# Altium project XBOT高端控制盒V1_1.PrjPcb
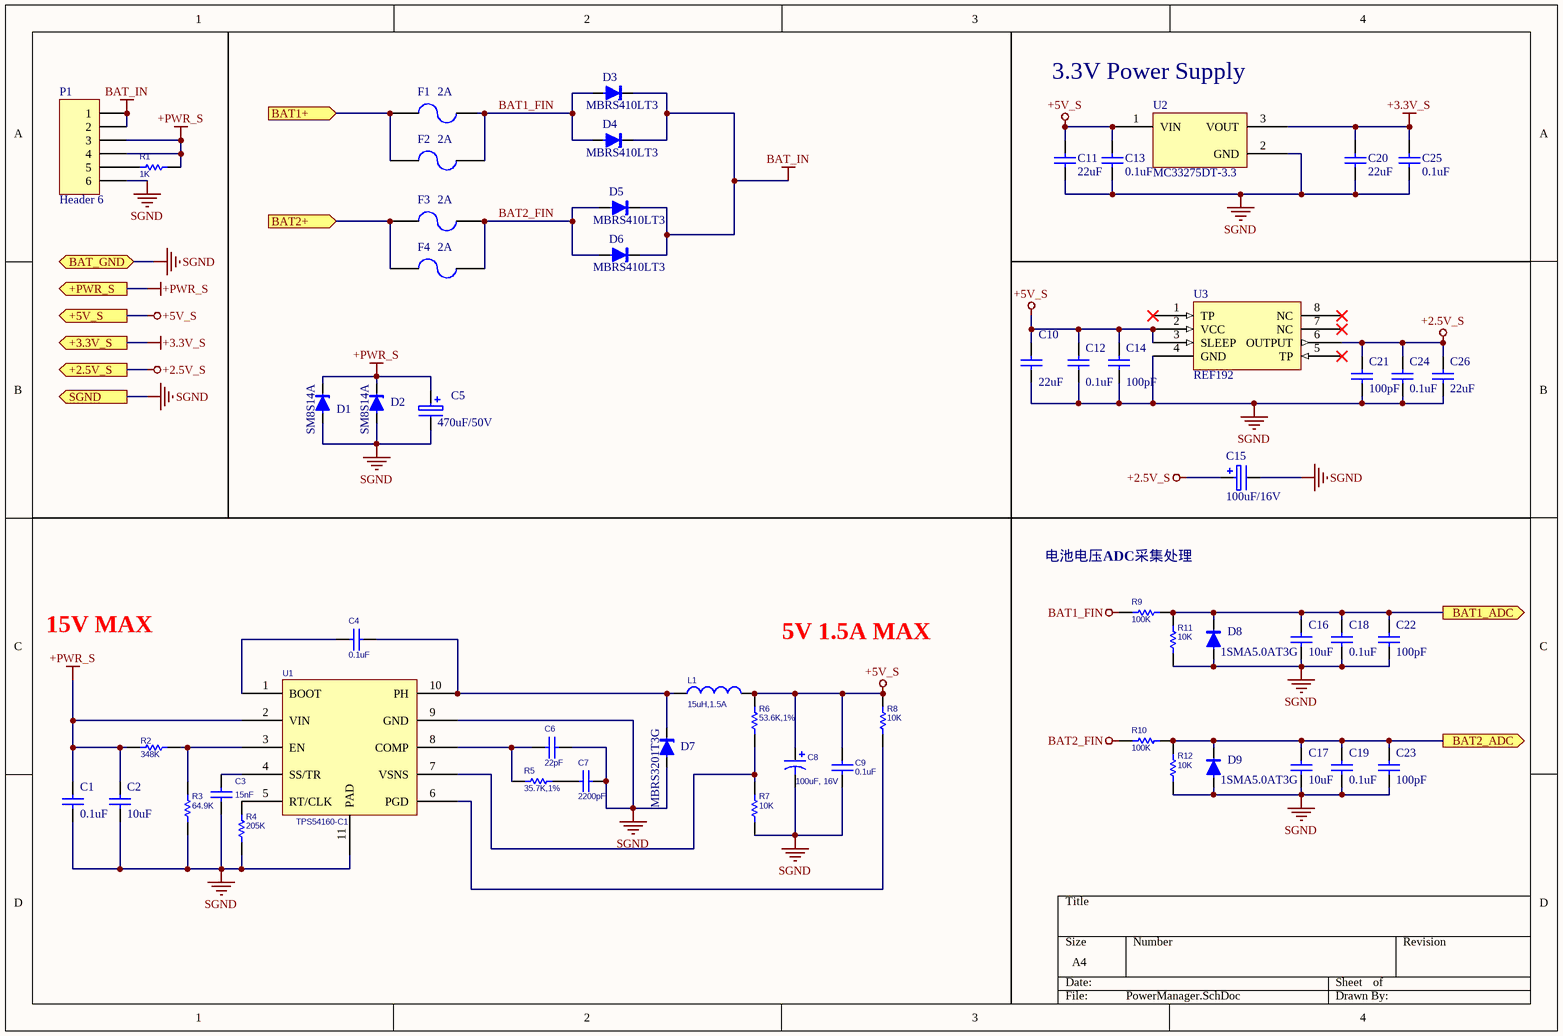
[diagram p0: PowerManager.SchDoc]
7 sheets, 289 parts. Net scope: global (net labels, ports and power ports of the same name join across sheets).
Board file: 控制盒基板.PcbDoc
Sheets:
  PowerManager.SchDoc
  KeyInput_ABH.SchDoc
  KeyInput_IJMEF.SchDoc
  JoyStickAdcInput.SchDoc
  OmapSystem.SchDoc
  TTL_TO_RS485.SchDoc
  RightInterface.SchDoc

## Sheet PowerManager.SchDoc
size A4

### Parts
C1  0.1uF  [C0805]
C2  10uF  [C1206]
C3  15nF  [C0805]
C4  0.1uF  [C0805]
C5  470uF/50V  [CT7343-E]
C6  22pF  [R0805]
C7  2200pF  [C0805]
C8  100uF, 16V  [CT7343-E]
C9  0.1uF  [C0805]
C10  22uF  [C1206]
C11  22uF  [C1206]
C12  0.1uF  [C0805]
C13  0.1uF  [C0805]
C14  100pF  [C0805]
C15  100uF/16V  [CT7343-E]
C16  10uF  [C1206]
C17  10uF  [C1206]
C18  0.1uF  [C1206]
C19  0.1uF  [C1206]
C20  22uF  [C1206]
C21  100pF  [C0805]
C22  100pF  [C1206]
C23  100pF  [C1206]
C24  0.1uF  [C0805]
C25  0.1uF  [C0805]
C26  22uF  [C1206]
D1  SM8S14A  [DO-218AB]
D2  SM8S14A  [DO-218AB]
D3  MBRS410LT3  [SMC]
D4  MBRS410LT3  [SMC]
D5  MBRS410LT3  [SMC]
D6  MBRS410LT3  [SMC]
D7  MBRS3201T3G  [DO-218AB]
D8  1SMA5.0AT3G  [SMA-S]
D9  1SMA5.0AT3G  [SMA-S]
F1  2A  [F1812]
F2  2A  [F1812]
F3  2A  [F1812]
F4  2A  [F1812]
L1  15uH,1.5A  [L5050-P]
P1  Header 6  [DS1X6-2.54]
R1  1K  [R0805]
R2  348K  [R0805]
R3  64.9K  [R0805]
R4  205K  [R0805]
R5  35.7K,1%  [R0805]
R6  53.6K,1%  [R0805]
R7  10K  [R0805]
R8  10K  [R0805]
R9  100K  [R0805]
R10  100K  [R0805]
R11  10K  [R0805]
R12  10K  [R0805]
U1  TPS54160-C1  [TSSO3X5-G10]
U2  MC33275DT-3.3  [TO-252]
U3  REF192  [SO-8]

### Ports
+2.5V_S (out), +3.3V_S (out), +5V_S (out), +PWR_S (out), BAT1+ (in), BAT1_ADC (out), BAT2+ (in), BAT2_ADC (out), BAT_GND, SGND (out)

### Nets
+2.5V_S: C15.1 C21.2 C24.2 C26.2 U3.6(OUTPUT) ; port +2.5V_S
+3.3V_S: C20.1 C25.2 U2.3(VOUT) ; port +3.3V_S
+5V_S: C8.1 C9.1 C10.2 C11.1 C12.2 C13.2 C14.2 L1.2 R6.2 R8.2 U2.1(VIN) U3.2(VCC) U3.3(SLEEP) ; port +5V_S
+PWR_S: C1.2 C2.2 C5.1 D1.2(K) D2.2(K) P1.3 P1.4 R1.1 R2.1 U1.2(VIN) ; port +PWR_S
BAT1_FIN: D3.1(A) D4.1(A) F1.2 F2.2 R9.1
BAT2_FIN: D5.1(A) D6.1(A) F3.2 F4.2 R10.1
BAT_IN: D3.2(K) D4.2(K) D5.2(K) D6.2(K) P1.1 P1.2
SGND: C1.1 C2.1 C3.1 C5.2 C6.1 C7.1 C8.2 C9.2 C10.1 C11.2 C12.1 C13.1 C14.1 C15.2 C16.1 C17.1 C18.1 C19.1 C20.2 C21.1 C22.1 C23.1 C24.1 C25.1 C26.1 D1.1(A) D2.1(A) D7.1(A) D8.1(A) D9.1(A) P1.6 R3.1 R4.1 R7.1 R11.2 R12.2 U1.9(GND) U1.11(PAD) U2.2(GND) U3.4(GND) ; port BAT_GND, port SGND
BAT1_ADC: C16.2 C18.2 C22.2 D8.2(K) R9.2 R11.1 ; port BAT1_ADC
BAT1_IN: F1.1 F2.1 ; port BAT1+
BAT2_ADC: C17.2 C19.2 C23.2 D9.2(K) R10.2 R12.1 ; port BAT2_ADC
BAT2_IN: F3.1 F4.1 ; port BAT2+
NetC3_2: C3.2 U1.4(SS/TR)
NetC4_1: C4.1 D7.2(K) L1.1 U1.10(PH)
NetC4_2: C4.2 U1.1(BOOT)
NetC6_2: C6.2 R5.2 U1.8(COMP)
NetC7_2: C7.2 R5.1
NetP1_5: P1.5 R1.2
NetR2_2: R2.2 R3.2 U1.3(EN)
NetR4_2: R4.2 U1.5(RT/CLK)
NetR6_1: R6.1 R7.2 U1.7(VSNS)
NetR8_1: R8.1 U1.6(PGD)

Not connected (* = marked no-connect by the designer): U3 1(TP)* 5(TP)* 7(NC)* 8(NC)*

### Notes on the sheet
- (near U2) 3.3V Power Supply
- (near R9) 电池电压ADC采集处理
- 15V MAX
- 5V 1.5A MAX

### Library data of the parts
C1 C2 C10-C14 C16-C26 = CAP: Published: 8-Jun-2000; LatestRevisionDate: 17-Jul-2002; LatestRevisionNote: Re-released for DXP Platform.; PackageReference: RAD-0.3; Publisher: Altium Limited
  C1 C12 C13 C18 C19 C24 C25: Value: 0.1uF
  C2 C16 C17: Value: 10uF
  C10 C11 C20 C26: Value: 22uF
  C14 C21-C23: Value: 100pF
C3 = Cap: CAP, CERAMIC, 15nF, 16V, X5R, 0603; Published: 8-Jun-2000; LatestRevisionDate: 17-Jul-2002; LatestRevisionNote: Re-released for DXP Platform.; PackageReference: RAD-0.3; Publisher: Altium Limited; Value: 15nF
C4 C9 = Cap: CAP, CERAMIC, 0.1UF, 16V, X5R, 0603; Value: 15nF; Published: 8-Jun-2000; LatestRevisionDate: 17-Jul-2002; LatestRevisionNote: Re-released for DXP Platform.; PackageReference: RAD-0.3; Publisher: Altium Limited
C5 = ELECTRO: Electrolytic Capacitor
C6 C7 = Cap: Capacitor; Value: 15nF; Published: 8-Jun-2000; LatestRevisionDate: 17-Jul-2002; LatestRevisionNote: Re-released for DXP Platform.; PackageReference: RAD-0.3; Publisher: Altium Limited
C8 = Cap Pol1: Polarized Capacitor (Radial); Value: 10uF; Published: 8-Jun-2000; LatestRevisionDate: 17-Jul-2002; LatestRevisionNote: Re-released for DXP Platform.; PackageReference: RB7.6-15; Publisher: Altium Limited
C15 = CAP-ELECTRO: Electrolytic Capacitor
D1-D7 = DIODE-ZENER: Small Signal Zener Diodes
D8 D9 = DIODE-SWITCHING: Silicon Epitaxial Planar Diodes
F1-F4 = FUSE2: Fuse
L1 = Inductor: Code_IEC: 1005; Value: 10mH; Published: 8-Jun-2000; LatestRevisionDate: 29-May-2009; LatestRevisionNote: IPC-7351 Footprint Added.; PackageReference: 0402-A; Publisher: Altium Limited; PackageDescription: Chip Inductor; Code_JEITA: 0402
P1 = Header 6: Header, 6-Pin; LatestRevisionDate: 17-Jul-2002; LatestRevisionNote: Re-released for DXP Platform.; Publisher: Altium Limited
R1 R3-R12 = Res1: Resistor; Value: 348K; Published: 8-Jun-2000; LatestRevisionDate: 17-Jul-2002; LatestRevisionNote: Re-released for DXP Platform.; PackageReference: AXIAL-0.3; Publisher: Altium Limited
R2 = Res1: Resistor; Published: 8-Jun-2000; LatestRevisionDate: 17-Jul-2002; LatestRevisionNote: Re-released for DXP Platform.; PackageReference: AXIAL-0.3; Publisher: Altium Limited; Value: 348K
U2 = MC78MXX: 3-Terminal 0.5A Positive Voltage Regulator; Published: 24-Mar-1999; LatestRevisionDate: 17-Jul-2002; LatestRevisionNote: Re-released for DXP Platform.; PackageReference: D2PAK; Publisher: Altium Limited; Code_JEDEC: SMD-220
U3 = REF192/5/7

## Sheet KeyInput_ABH.SchDoc
size A4
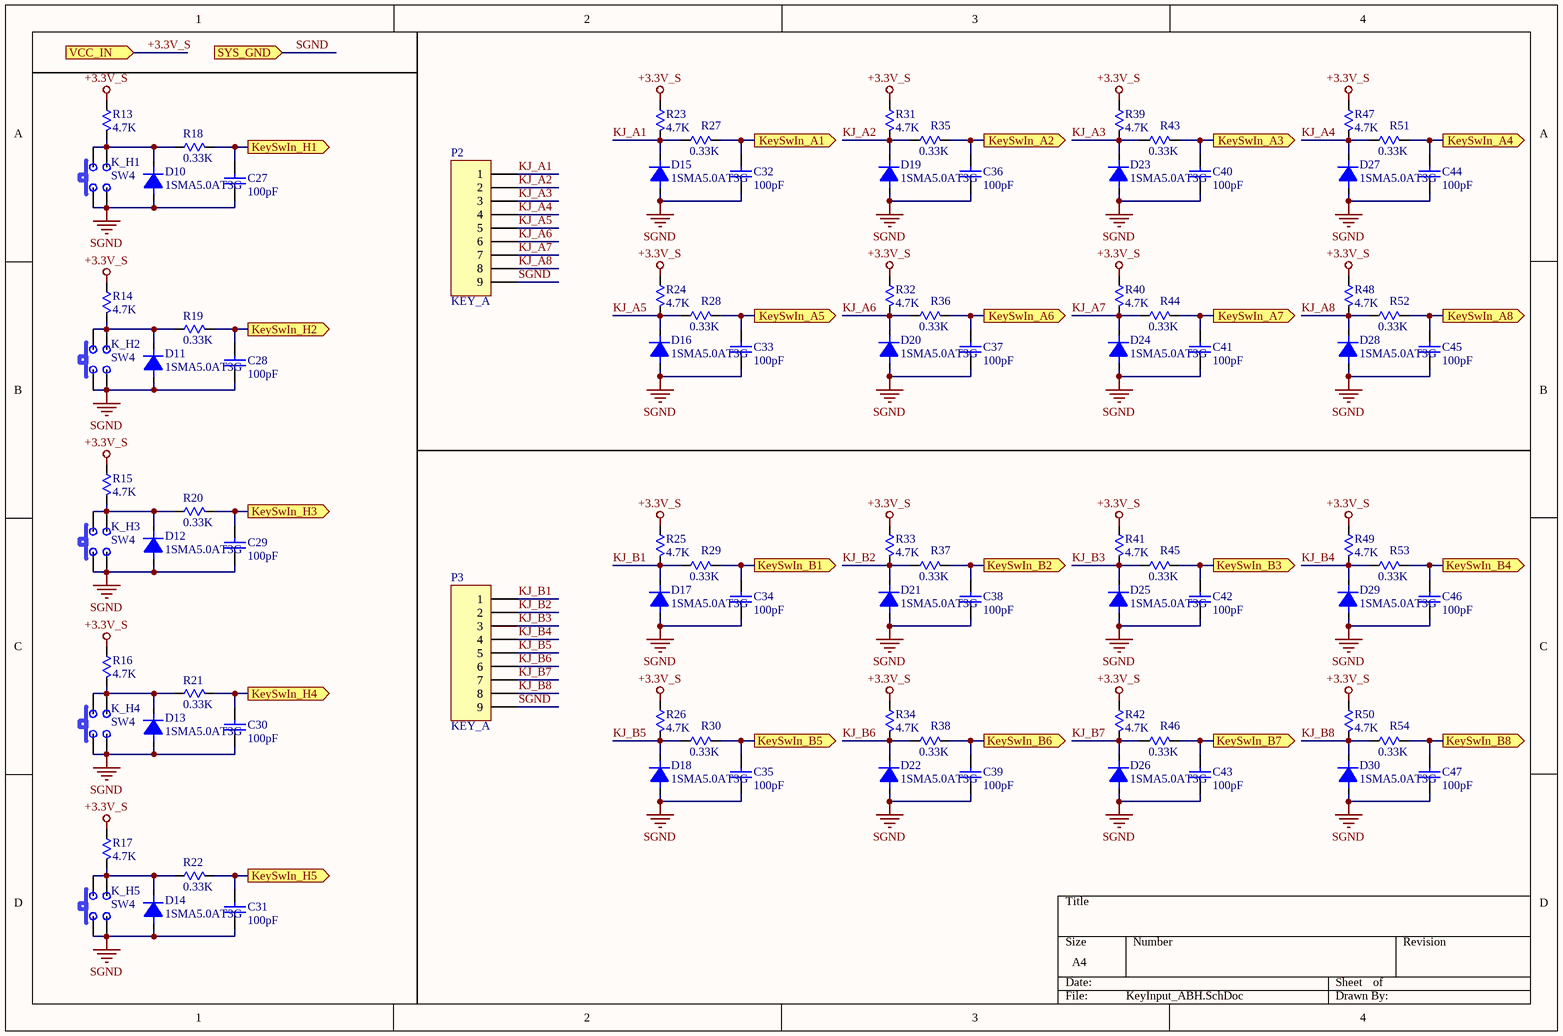
[diagram p1: KeyInput_ABH.SchDoc]

### Parts
C27  100pF  [C0805]
C28  100pF  [C0805]
C29  100pF  [C0805]
C30  100pF  [C0805]
C31  100pF  [C0805]
C32  100pF  [C0805]
C33  100pF  [C0805]
C34  100pF  [C0805]
C35  100pF  [C0805]
C36  100pF  [C0805]
C37  100pF  [C0805]
C38  100pF  [C0805]
C39  100pF  [C0805]
C40  100pF  [C0805]
C41  100pF  [C0805]
C42  100pF  [C0805]
C43  100pF  [C0805]
C44  100pF  [C0805]
C45  100pF  [C0805]
C46  100pF  [C0805]
C47  100pF  [C0805]
D10  1SMA5.0AT3G  [SMA]
D11  1SMA5.0AT3G  [SMA]
D12  1SMA5.0AT3G  [SMA]
D13  1SMA5.0AT3G  [SMA]
D14  1SMA5.0AT3G  [SMA]
D15  1SMA5.0AT3G  [SMA]
D16  1SMA5.0AT3G  [SMA]
D17  1SMA5.0AT3G  [SMA]
D18  1SMA5.0AT3G  [SMA]
D19  1SMA5.0AT3G  [SMA]
D20  1SMA5.0AT3G  [SMA]
D21  1SMA5.0AT3G  [SMA]
D22  1SMA5.0AT3G  [SMA]
D23  1SMA5.0AT3G  [SMA]
D24  1SMA5.0AT3G  [SMA]
D25  1SMA5.0AT3G  [SMA]
D26  1SMA5.0AT3G  [SMA]
D27  1SMA5.0AT3G  [SMA]
D28  1SMA5.0AT3G  [SMA]
D29  1SMA5.0AT3G  [SMA]
D30  1SMA5.0AT3G  [SMA]
K_H1  SW4  [SW-MEC]
K_H2  SW4  [SW-MEC]
K_H3  SW4  [SW-MEC]
K_H4  SW4  [SW-MEC]
K_H5  SW4  [SW-MEC]
P2  KEY_A  [HDR1X9]
P3  KEY_A  [HDR1X9]
R13  4.7K  [R0805]
R14  4.7K  [R0805]
R15  4.7K  [R0805]
R16  4.7K  [R0805]
R17  4.7K  [R0805]
R18  0.33K  [R0805]
R19  0.33K  [R0805]
R20  0.33K  [R0805]
R21  0.33K  [R0805]
R22  0.33K  [R0805]
R23  4.7K  [R0805]
R24  4.7K  [R0805]
R25  4.7K  [R0805]
R26  4.7K  [R0805]
R27  0.33K  [R0805]
R28  0.33K  [R0805]
R29  0.33K  [R0805]
R30  0.33K  [R0805]
R31  4.7K  [R0805]
R32  4.7K  [R0805]
R33  4.7K  [R0805]
R34  4.7K  [R0805]
R35  0.33K  [R0805]
R36  0.33K  [R0805]
R37  0.33K  [R0805]
R38  0.33K  [R0805]
R39  4.7K  [R0805]
R40  4.7K  [R0805]
R41  4.7K  [R0805]
R42  4.7K  [R0805]
R43  0.33K  [R0805]
R44  0.33K  [R0805]
R45  0.33K  [R0805]
R46  0.33K  [R0805]
R47  4.7K  [R0805]
R48  4.7K  [R0805]
R49  4.7K  [R0805]
R50  4.7K  [R0805]
R51  0.33K  [R0805]
R52  0.33K  [R0805]
R53  0.33K  [R0805]
R54  0.33K  [R0805]

### Ports
KeySwIn_A1 (out), KeySwIn_A2 (out), KeySwIn_A3 (out), KeySwIn_A4 (out), KeySwIn_A5 (out), KeySwIn_A6 (out), KeySwIn_A7 (out), KeySwIn_A8 (out), KeySwIn_B1 (out), KeySwIn_B2 (out), KeySwIn_B3 (out), KeySwIn_B4 (out), KeySwIn_B5 (out), KeySwIn_B6 (out), KeySwIn_B7 (out), KeySwIn_B8 (out), KeySwIn_H1 (out), KeySwIn_H2 (out), KeySwIn_H3 (out), KeySwIn_H4 (out), KeySwIn_H5 (out), SYS_GND (in), VCC_IN (in)

### Nets
+3.3V_S: R13.2 R14.2 R15.2 R16.2 R17.2 R23.2 R24.2 R25.2 R26.2 R31.2 R32.2 R33.2 R34.2 R39.2 R40.2 R41.2 R42.2 R47.2 R48.2 R49.2 R50.2 ; port VCC_IN
SGND: C27.2 C28.2 C29.2 C30.2 C31.2 C32.2 C33.2 C34.2 C35.2 C36.2 C37.2 C38.2 C39.2 C40.2 C41.2 C42.2 C43.2 C44.2 C45.2 C46.2 C47.2 D10.1(A) D11.1(A) D12.1(A) D13.1(A) D14.1(A) D15.1(A) D16.1(A) D17.1(A) D18.1(A) D19.1(A) D20.1(A) D21.1(A) D22.1(A) D23.1(A) D24.1(A) D25.1(A) D26.1(A) D27.1(A) D28.1(A) D29.1(A) D30.1(A) K_H1.1 K_H2.1 K_H3.1 K_H4.1 K_H5.1 P2.9 P3.9 ; port SYS_GND
KeySwIn_A1: C32.1 R27.1 ; port KeySwIn_A1
KeySwIn_A2: C36.1 R35.1 ; port KeySwIn_A2
KeySwIn_A3: C40.1 R43.1 ; port KeySwIn_A3
KeySwIn_A4: C44.1 R51.1 ; port KeySwIn_A4
KeySwIn_A5: C33.1 R28.1 ; port KeySwIn_A5
KeySwIn_A6: C37.1 R36.1 ; port KeySwIn_A6
KeySwIn_A7: C41.1 R44.1 ; port KeySwIn_A7
KeySwIn_A8: C45.1 R52.1 ; port KeySwIn_A8
KeySwIn_B1: C34.1 R29.1 ; port KeySwIn_B1
KeySwIn_B2: C38.1 R37.1 ; port KeySwIn_B2
KeySwIn_B3: C42.1 R45.1 ; port KeySwIn_B3
KeySwIn_B4: C46.1 R53.1 ; port KeySwIn_B4
KeySwIn_B5: C35.1 R30.1 ; port KeySwIn_B5
KeySwIn_B6: C39.1 R38.1 ; port KeySwIn_B6
KeySwIn_B7: C43.1 R46.1 ; port KeySwIn_B7
KeySwIn_B8: C47.1 R54.1 ; port KeySwIn_B8
KeySwIn_H1: C27.1 R18.1 ; port KeySwIn_H1
KeySwIn_H2: C28.1 R19.1 ; port KeySwIn_H2
KeySwIn_H3: C29.1 R20.1 ; port KeySwIn_H3
KeySwIn_H4: C30.1 R21.1 ; port KeySwIn_H4
KeySwIn_H5: C31.1 R22.1 ; port KeySwIn_H5
KJ_A1: D15.2(K) P2.1 R23.1 R27.2
KJ_A2: D19.2(K) P2.2 R31.1 R35.2
KJ_A3: D23.2(K) P2.3 R39.1 R43.2
KJ_A4: D27.2(K) P2.4 R47.1 R51.2
KJ_A5: D16.2(K) P2.5 R24.1 R28.2
KJ_A6: D20.2(K) P2.6 R32.1 R36.2
KJ_A7: D24.2(K) P2.7 R40.1 R44.2
KJ_A8: D28.2(K) P2.8 R48.1 R52.2
KJ_B1: D17.2(K) P3.1 R25.1 R29.2
KJ_B2: D21.2(K) P3.2 R33.1 R37.2
KJ_B3: D25.2(K) P3.3 R41.1 R45.2
KJ_B4: D29.2(K) P3.4 R49.1 R53.2
KJ_B5: D18.2(K) P3.5 R26.1 R30.2
KJ_B6: D22.2(K) P3.6 R34.1 R38.2
KJ_B7: D26.2(K) P3.7 R42.1 R46.2
KJ_B8: D30.2(K) P3.8 R50.1 R54.2
NetD10_2: D10.2(K) K_H1.2 R13.1 R18.2
NetD11_2: D11.2(K) K_H2.2 R14.1 R19.2
NetD12_2: D12.2(K) K_H3.2 R15.1 R20.2
NetD13_2: D13.2(K) K_H4.2 R16.1 R21.2
NetD14_2: D14.2(K) K_H5.2 R17.1 R22.2

### Library data of the parts
C27-C47 = Cap: Capacitor; Value: 22pF; Published: 8-Jun-2000; Revision: July-2002: Re-released for DXP Platform.; Publisher: Altium Limited
D10-D30 = DIODE1: Diode
K_H1-K_H5 = SW-key
P2 P3 = Header 9: Header, 9-Pin; LatestRevisionDate: 17-Jul-2002; LatestRevisionNote: Re-released for DXP Platform.; Publisher: Altium Limited
R13-R54 = RES: Resistor; Published: 8-Jun-2000; LatestRevisionDate: 17-Jul-2002; LatestRevisionNote: Re-released for DXP Platform.; PackageReference: AXIAL-0.3; Publisher: Altium Limited
  R13-R17 R23-R26 R31-R34 R39-R42 R47-R50: Value: 4.7K
  R18-R22 R27-R30 R35-R38 R43-R46 R51-R54: Value: 0.33K

## Sheet KeyInput_IJMEF.SchDoc
size A4
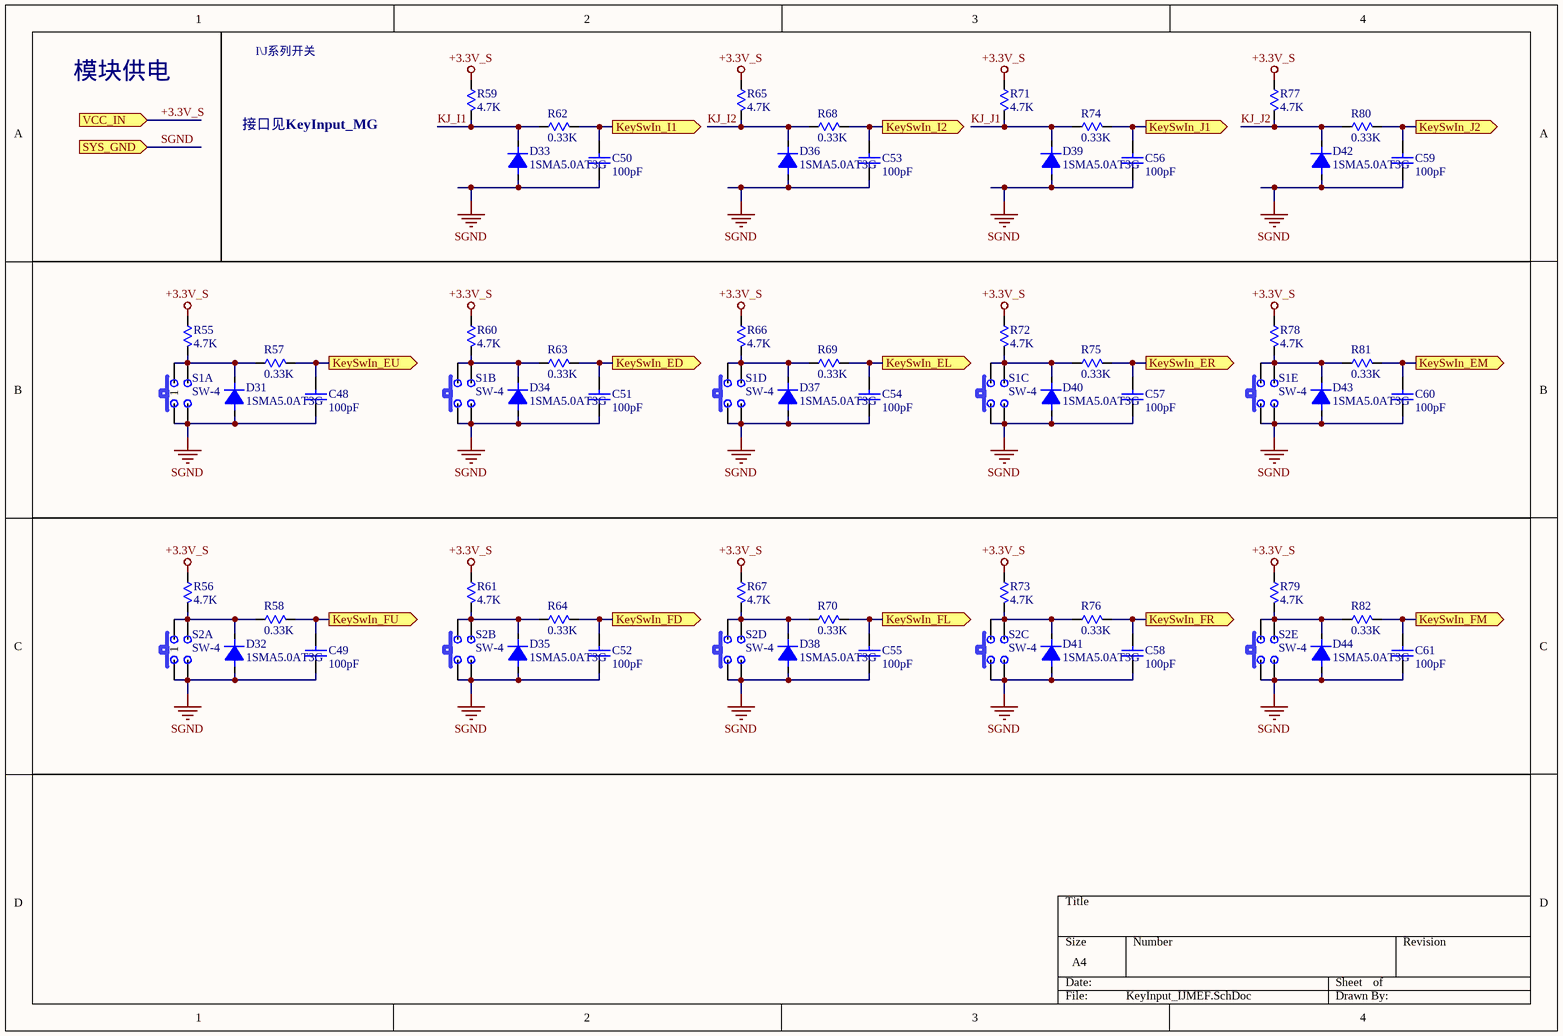
[diagram p2: KeyInput_IJMEF.SchDoc]

### Parts
C48  100pF  [C0805]
C49  100pF  [C0805]
C50  100pF  [C0805]
C51  100pF  [C0805]
C52  100pF  [C0805]
C53  100pF  [C0805]
C54  100pF  [C0805]
C55  100pF  [C0805]
C56  100pF  [C0805]
C57  100pF  [C0805]
C58  100pF  [C0805]
C59  100pF  [C0805]
C60  100pF  [C0805]
C61  100pF  [C0805]
D31  1SMA5.0AT3G  [SMA]
D32  1SMA5.0AT3G  [SMA]
D33  1SMA5.0AT3G  [SMA]
D34  1SMA5.0AT3G  [SMA]
D35  1SMA5.0AT3G  [SMA]
D36  1SMA5.0AT3G  [SMA]
D37  1SMA5.0AT3G  [SMA]
D38  1SMA5.0AT3G  [SMA]
D39  1SMA5.0AT3G  [SMA]
D40  1SMA5.0AT3G  [SMA]
D41  1SMA5.0AT3G  [SMA]
D42  1SMA5.0AT3G  [SMA]
D43  1SMA5.0AT3G  [SMA]
D44  1SMA5.0AT3G  [SMA]
R55  4.7K  [R0805]
R56  4.7K  [R0805]
R57  0.33K  [R0805]
R58  0.33K  [R0805]
R59  4.7K  [R0805]
R60  4.7K  [R0805]
R61  4.7K  [R0805]
R62  0.33K  [R0805]
R63  0.33K  [R0805]
R64  0.33K  [R0805]
R65  4.7K  [R0805]
R66  4.7K  [R0805]
R67  4.7K  [R0805]
R68  0.33K  [R0805]
R69  0.33K  [R0805]
R70  0.33K  [R0805]
R71  4.7K  [R0805]
R72  4.7K  [R0805]
R73  4.7K  [R0805]
R74  0.33K  [R0805]
R75  0.33K  [R0805]
R76  0.33K  [R0805]
R77  4.7K  [R0805]
R78  4.7K  [R0805]
R79  4.7K  [R0805]
R80  0.33K  [R0805]
R81  0.33K  [R0805]
R82  0.33K  [R0805]
S1  SW-4  [SW-MEC-5]  (parts A,B,C,D,E of 5)
S2  SW-4  [SW-MEC-5]  (parts A,B,C,D,E of 5)

### Ports
KeySwIn_ED (out), KeySwIn_EL (out), KeySwIn_EM (out), KeySwIn_ER (out), KeySwIn_EU (out), KeySwIn_FD (out), KeySwIn_FL (out), KeySwIn_FM (out), KeySwIn_FR (out), KeySwIn_FU (out), KeySwIn_I1 (out), KeySwIn_I2 (out), KeySwIn_J1 (out), KeySwIn_J2 (out), SYS_GND (in), VCC_IN (in)

### Nets
+3.3V_S: R55.2 R56.2 R59.2 R60.2 R61.2 R65.2 R66.2 R67.2 R71.2 R72.2 R73.2 R77.2 R78.2 R79.2 ; port VCC_IN
SGND: C48.2 C49.2 C50.2 C51.2 C52.2 C53.2 C54.2 C55.2 C56.2 C57.2 C58.2 C59.2 C60.2 C61.2 D31.1(A) D32.1(A) D33.1(A) D34.1(A) D35.1(A) D36.1(A) D37.1(A) D38.1(A) D39.1(A) D40.1(A) D41.1(A) D42.1(A) D43.1(A) D44.1(A) S1.1 S1.3 S1.5 S1.7 S1.9 S2.1 S2.3 S2.5 S2.7 S2.9 ; port SYS_GND
KeySwIn_ED: C51.1 R63.1 ; port KeySwIn_ED
KeySwIn_EL: C54.1 R69.1 ; port KeySwIn_EL
KeySwIn_EM: C60.1 R81.1 ; port KeySwIn_EM
KeySwIn_ER: C57.1 R75.1 ; port KeySwIn_ER
KeySwIn_EU: C48.1 R57.1 ; port KeySwIn_EU
KeySwIn_FD: C52.1 R64.1 ; port KeySwIn_FD
KeySwIn_FL: C55.1 R70.1 ; port KeySwIn_FL
KeySwIn_FM: C61.1 R82.1 ; port KeySwIn_FM
KeySwIn_FR: C58.1 R76.1 ; port KeySwIn_FR
KeySwIn_FU: C49.1 R58.1 ; port KeySwIn_FU
KeySwIn_I1: C50.1 R62.1 ; port KeySwIn_I1
KeySwIn_I2: C53.1 R68.1 ; port KeySwIn_I2
KeySwIn_J1: C56.1 R74.1 ; port KeySwIn_J1
KeySwIn_J2: C59.1 R80.1 ; port KeySwIn_J2
KJ_I1: D33.2(K) R59.1 R62.2
KJ_I2: D36.2(K) R65.1 R68.2
KJ_J1: D39.2(K) R71.1 R74.2
KJ_J2: D42.2(K) R77.1 R80.2
NetD31_2: D31.2(K) R55.1 R57.2 S1.2
NetD32_2: D32.2(K) R56.1 R58.2 S2.2
NetD34_2: D34.2(K) R60.1 R63.2 S1.4
NetD35_2: D35.2(K) R61.1 R64.2 S2.4
NetD37_2: D37.2(K) R66.1 R69.2 S1.8
NetD38_2: D38.2(K) R67.1 R70.2 S2.8
NetD40_2: D40.2(K) R72.1 R75.2 S1.6
NetD41_2: D41.2(K) R73.1 R76.2 S2.6
NetD43_2: D43.2(K) R78.1 R81.2 S1.10
NetD44_2: D44.2(K) R79.1 R82.2 S2.10

### Notes on the sheet
- 模块供电
- I\J系列开关
- 接口见KeyInput_MG

### Library data of the parts
C48-C61 = Cap: Capacitor; Value: 22pF; Published: 8-Jun-2000; Revision: July-2002: Re-released for DXP Platform.; Publisher: Altium Limited
D31-D44 = DIODE1: Diode
R55-R82 = RES: Resistor; Published: 8-Jun-2000; LatestRevisionDate: 17-Jul-2002; LatestRevisionNote: Re-released for DXP Platform.; PackageReference: AXIAL-0.3; Publisher: Altium Limited
  R55 R56 R59-R61 R65-R67 R71-R73 R77-R79: Value: 4.7K
  R57 R58 R62-R64 R68-R70 R74-R76 R80-R82: Value: 0.33K

## Sheet JoyStickAdcInput.SchDoc
size A4
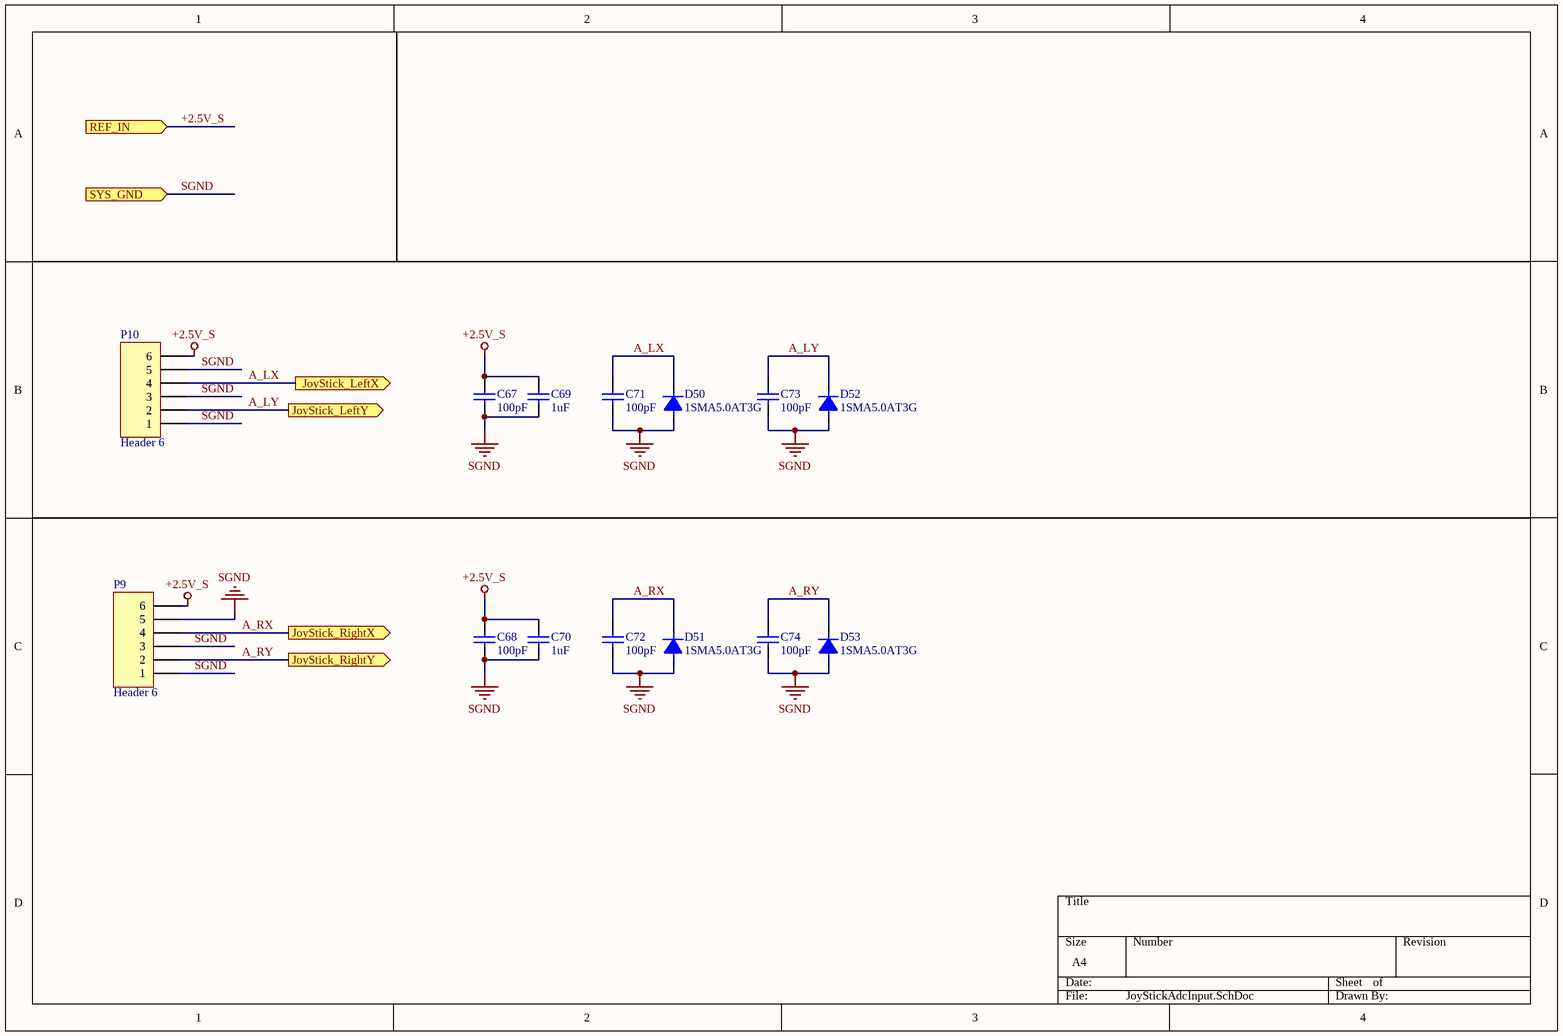
[diagram p3: JoyStickAdcInput.SchDoc]

### Parts
C67  100pF  [C0805]
C68  100pF  [C0805]
C69  1uF  [C0805]
C70  1uF  [C0805]
C71  100pF  [C0805]
C72  100pF  [C0805]
C73  100pF  [C0805]
C74  100pF  [C0805]
D50  1SMA5.0AT3G  [SMA]
D51  1SMA5.0AT3G  [SMA]
D52  1SMA5.0AT3G  [SMA]
D53  1SMA5.0AT3G  [SMA]
P9  Header 6  [FFC/SM1.0-6]
P10  Header 6  [FFC/SM1.0-6]

### Ports
JoyStick_LeftX (out), JoyStick_LeftY (out), JoyStick_RightX (out), JoyStick_RightY (out), REF_IN (in), SYS_GND (in)

### Nets
+2.5V_S: C67.1 C68.1 C69.1 C70.1 P9.6 P10.6 ; port REF_IN
SGND: C67.2 C68.2 C69.2 C70.2 C71.2 C72.2 C73.2 C74.2 D50.1(A) D51.1(A) D52.1(A) D53.1(A) P9.1 P9.3 P9.5 P10.1 P10.3 P10.5 ; port SYS_GND
A_LX: C71.1 D50.2(K) P10.4 ; port JoyStick_LeftX
A_LY: C73.1 D52.2(K) P10.2 ; port JoyStick_LeftY
A_RX: C72.1 D51.2(K) P9.4 ; port JoyStick_RightX
A_RY: C74.1 D53.2(K) P9.2 ; port JoyStick_RightY

### Library data of the parts
C67-C74 = Cap: Capacitor; Value: 22pF; Published: 8-Jun-2000; Revision: July-2002: Re-released for DXP Platform.; Publisher: Altium Limited
D50-D53 = DIODE1: Diode
P9 P10 = Header 6: Header, 6-Pin; LatestRevisionDate: 17-Jul-2002; LatestRevisionNote: Re-released for DXP Platform.; Publisher: Altium Limited

## Sheet OmapSystem.SchDoc
size A4
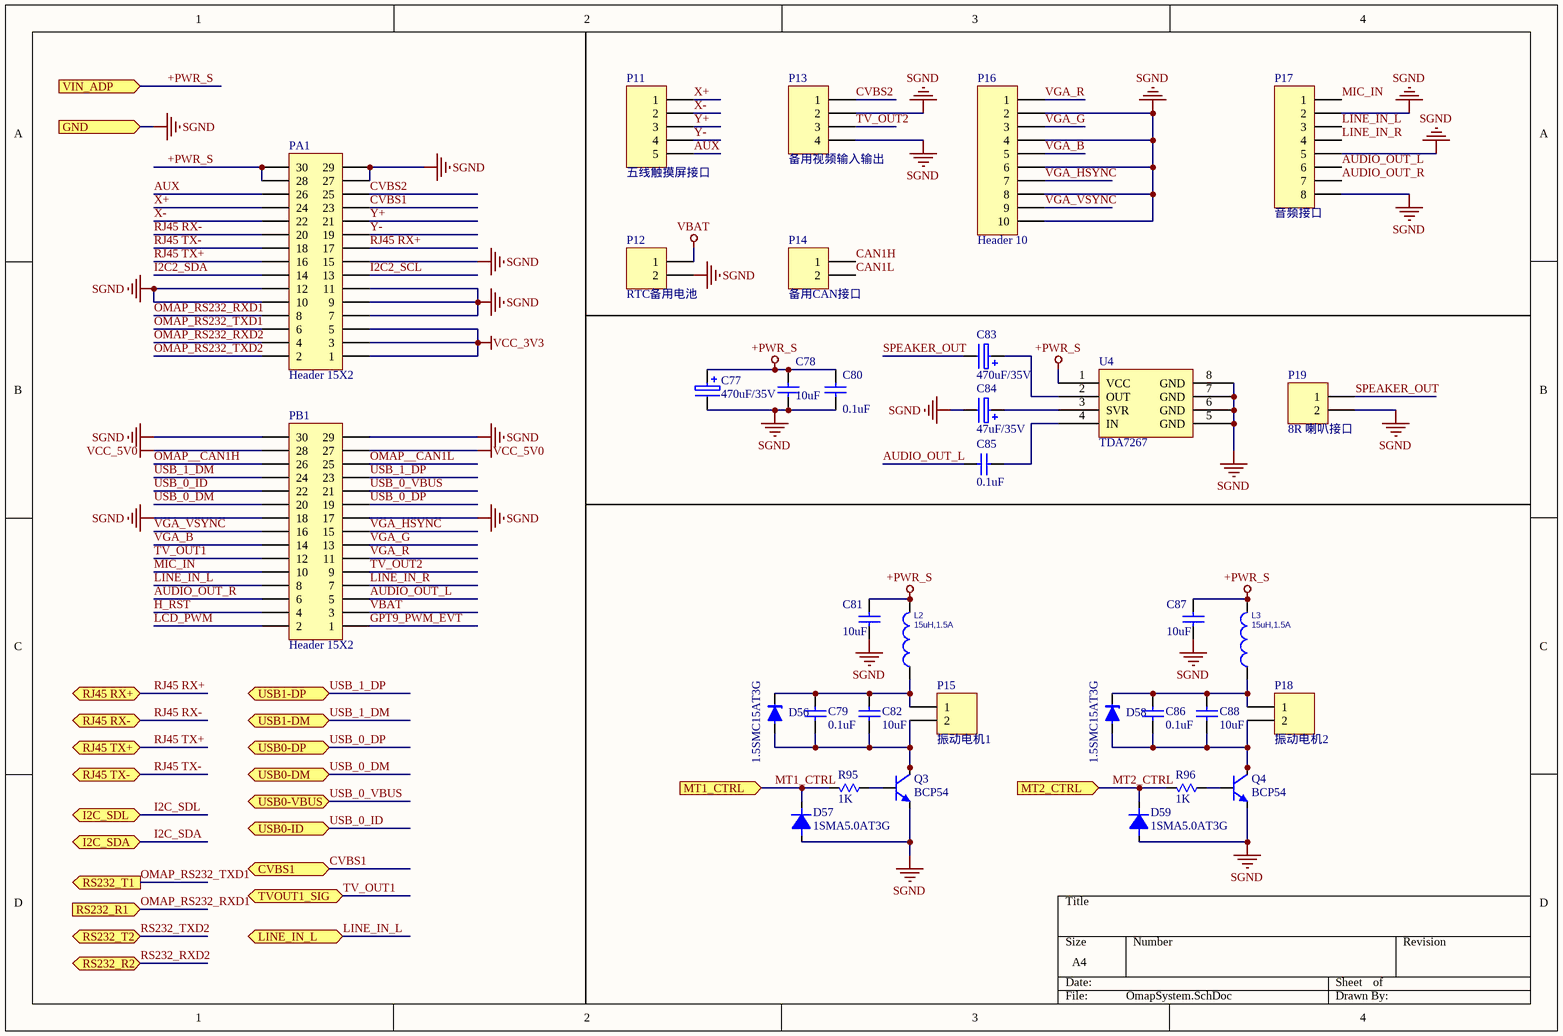
[diagram p4: OmapSystem.SchDoc]

### Parts
C77  470uF/35V  [CT7343-E]
C78  10uF  [C1206]
C79  0.1uF  [C0805]
C80  0.1uF  [C0805]
C81  10uF  [C1206]
C82  10uF  [C1206]
C83  470uF/35V  [CT7343-E]
C84  47uF/35V  [CT7343-D]
C85  0.1uF  [C0805]
C86  0.1uF  [C0805]
C87  10uF  [C1206]
C88  10uF  [C1206]
D56  1.5SMC15AT3G  [SMC]
D57  1SMA5.0AT3G  [SMA]
D58  1.5SMC15AT3G  [SMC]
D59  1SMA5.0AT3G  [SMA]
L2  15uH,1.5A  [L3030-P]
L3  15uH,1.5A  [L3030-P]
P11  五线触摸屏接口  [DS1X5-2.54]
P12  RTC备用电池  [CR2428]
P13  备用视频输入输出  [DS1X4-2.54]
P14  备用CAN接口  [DS1X2-2.54]
P15  振动电机1  [1MM25_2PIN_SMT_R90]
P16  Header 10  [DS1X10-2.54]
P17  音频接口  [DS1X8-2.54]
P18  振动电机2  [1MM25_2PIN_SMT_R90]
P19  8R 喇叭接口  [DS1X2-2.54]
PA1  Header 15X2  [HDR2X15]
PB1  Header 15X2  [HDR2X15]
Q3  BCP54  [SOT-223]
Q4  BCP54  [SOT-223]
R95  1K  [R0805]
R96  1K  [R0805]
U4  TDA7267  [DIP8]

### Ports
CVBS1 (bidir), GND (in), I2C_SDA (bidir), I2C_SDL (bidir), LINE_IN_L (bidir), MT1_CTRL (in), MT2_CTRL (in), RJ45 RX+ (bidir), RJ45 RX- (bidir), RJ45 TX+ (bidir), RJ45 TX- (bidir), RS232_R1 (in), RS232_R2 (bidir), RS232_T1 (out), RS232_T2 (bidir), TVOUT1_SIG (bidir), USB0-DM (bidir), USB0-DP (bidir), USB0-ID (bidir), USB0-VBUS (bidir), USB1-DM (bidir), USB1-DP (bidir), VIN_ADP (in)

### Nets
+PWR_S: C77.1 C78.2 C80.2 C81.2 C87.2 L2.2 L3.2 PA1.28 PA1.30 U4.1(VCC) ; port VIN_ADP
SGND: C77.2 C78.1 C80.1 C81.1 C84.2 C87.1 D57.1(A) D59.1(A) P12.2 P13.2 P13.4 P16.2 P16.4 P16.6 P16.8 P16.10 P17.2 P17.5 P17.8 P19.2 PA1.7 PA1.9 PA1.10 PA1.11 PA1.12 PA1.15 PA1.27 PA1.29 PB1.17 PB1.18 PB1.29 PB1.30 Q3.3(E) Q4.3(E) U4.5(GND) U4.6(GND) U4.7(GND) U4.8(GND) ; port GND
VBAT: P12.1 PB1.3
VCC_3V3: PA1.1 PA1.3 PA1.5
VCC_5V0: PB1.27 PB1.28
AUDIO_OUT_L: C85.1 P17.6 PB1.5
AUDIO_OUT_R: P17.7 PB1.6
AUX: P11.5 PA1.26
CAN1H: P14.1
CAN1L: P14.2
CVBS1: PA1.23 ; port CVBS1
CVBS2: P13.1 PA1.25
GPT9_PWM_EVT: PB1.1
H_RST: PB1.4
I2C2_SCL: PA1.13
I2C2_SDA: PA1.14
I2C_SDA: port I2C_SDA
I2C_SDL: port I2C_SDL
LCD_PWM: PB1.2
LINE_IN_L: P17.3 PB1.8 ; port LINE_IN_L
LINE_IN_R: P17.4 PB1.7
MIC_IN: P17.1 PB1.10
MT1_CTRL: D57.2(K) R95.2 ; port MT1_CTRL
MT2_CTRL: D59.2(K) R96.2 ; port MT2_CTRL
OMAP__CAN1H: PB1.26
OMAP__CAN1L: PB1.25
OMAP_RS232_RXD1: PA1.8 ; port RS232_R1
OMAP_RS232_RXD2: PA1.4
OMAP_RS232_TXD1: PA1.6 ; port RS232_T1
OMAP_RS232_TXD2: PA1.2
RJ45 RX+: PA1.17 ; port RJ45 RX+
RJ45 RX-: PA1.20 ; port RJ45 RX-
RJ45 TX+: PA1.16 ; port RJ45 TX+
RJ45 TX-: PA1.18 ; port RJ45 TX-
RS232_RXD2: port RS232_R2
RS232_TXD2: port RS232_T2
SPEAKER_OUT: C83.2 P19.1
TV_OUT1: PB1.12 ; port TVOUT1_SIG
TV_OUT2: P13.3 PB1.9
USB_0_DM: PB1.20 ; port USB0-DM
USB_0_DP: PB1.19 ; port USB0-DP
USB_0_ID: PB1.22 ; port USB0-ID
USB_0_VBUS: PB1.21 ; port USB0-VBUS
USB_1_DM: PB1.24 ; port USB1-DM
USB_1_DP: PB1.23 ; port USB1-DP
VGA_B: P16.5 PB1.14
VGA_G: P16.3 PB1.13
VGA_HSYNC: P16.7 PB1.15
VGA_R: P16.1 PB1.11
VGA_VSYNC: P16.9 PB1.16
X+: P11.1 PA1.24
X-: P11.2 PA1.22
Y+: P11.3 PA1.21
Y-: P11.4 PA1.19
NetC79_1: C79.1 C82.2 D56.1(A) P15.2 Q3.2(C) Q3.4(C)
NetC79_2: C79.2 C82.1 D56.2(K) L2.1 P15.1
NetC83_1: C83.1 U4.2(OUT)
NetC84_1: C84.1 U4.3(SVR)
NetC85_2: C85.2 U4.4(IN)
NetC86_1: C86.1 C88.2 D58.1(A) P18.2 Q4.2(C) Q4.4(C)
NetC86_2: C86.2 C88.1 D58.2(K) L3.1 P18.1
NetQ3_1: Q3.1(B) R95.1
NetQ4_1: Q4.1(B) R96.1

### Library data of the parts
C77 C83 C84 = ELECTRO: Electrolytic Capacitor
C78 C80-C82 C87 C88 = CAP: Published: 8-Jun-2000; LatestRevisionDate: 17-Jul-2002; LatestRevisionNote: Re-released for DXP Platform.; PackageReference: RAD-0.3; Publisher: Altium Limited
  C78 C81 C82 C87 C88: Value: 10uF
  C80: Value: 0.1uF
C79 C85 C86 = Cap: Capacitor; Published: 8-Jun-2000; Revision: July-2002: Re-released for DXP Platform.; Publisher: Altium Limited; Value: 0.1uF
D56 D58 = DIODE-ZENER: Small Signal Zener Diodes
D57 D59 = DIODE1: Diode
L2 L3 = Inductor: Code_IEC: 1005; Value: 10mH; Published: 8-Jun-2000; LatestRevisionDate: 29-May-2009; LatestRevisionNote: IPC-7351 Footprint Added.; PackageReference: 0402-A; Publisher: Altium Limited; PackageDescription: Chip Inductor; Code_JEITA: 0402
P11 = Header 5: Header, 5-Pin; LatestRevisionDate: 17-Jul-2002; LatestRevisionNote: Re-released for DXP Platform.; Publisher: Altium Limited
P12 P14 P15 P18 P19 = Header 2: Header, 2-Pin; LatestRevisionDate: 17-Jul-2002; LatestRevisionNote: Re-released for DXP Platform.; Publisher: Altium Limited
P13 = Header 4: Header, 4-Pin; LatestRevisionDate: 17-Jul-2002; LatestRevisionNote: Re-released for DXP Platform.; Publisher: Altium Limited
P16 = Header 10: Header, 10-Pin; LatestRevisionDate: 17-Jul-2002; LatestRevisionNote: Re-released for DXP Platform.; Publisher: Altium Limited
P17 = Header 8: Header, 8-Pin; LatestRevisionDate: 17-Jul-2002; LatestRevisionNote: Re-released for DXP Platform.; Publisher: Altium Limited
PA1 PB1 = Header 15X2: Header, 15-Pin, Dual row; LatestRevisionDate: 17-Jul-2002; LatestRevisionNote: Re-released for DXP Platform.; Publisher: Altium Limited
R95 R96 = RES: Resistor; Published: 8-Jun-2000; LatestRevisionDate: 17-Jul-2002; LatestRevisionNote: Re-released for DXP Platform.; PackageReference: AXIAL-0.3; Publisher: Altium Limited; Value: 1K
U4 = TDA7267: 2W功放芯片
Q3 Q4 = BCP54: Published: 8-Jun-2000; LatestRevisionDate: 15-Jan-2003; LatestRevisionNote: PCB Footprint 'BCY-W3/D4.7' replaced; DatasheetDocument: 1997; PackageDocument: Sep-1998; PackageReference: TO-92A; Publisher: Altium Limited; Code_JEDEC: TO-92A; ComponentLink1Description: Manufacturer Link; ComponentLink1URL: http://www.fairchildsemi.com/; ComponentLink2Description: Datasheet; ComponentLink2URL: http://www.fairchildsemi.com/ds/2N%2F2N3904.pdf

## Sheet TTL_TO_RS485.SchDoc
size A4
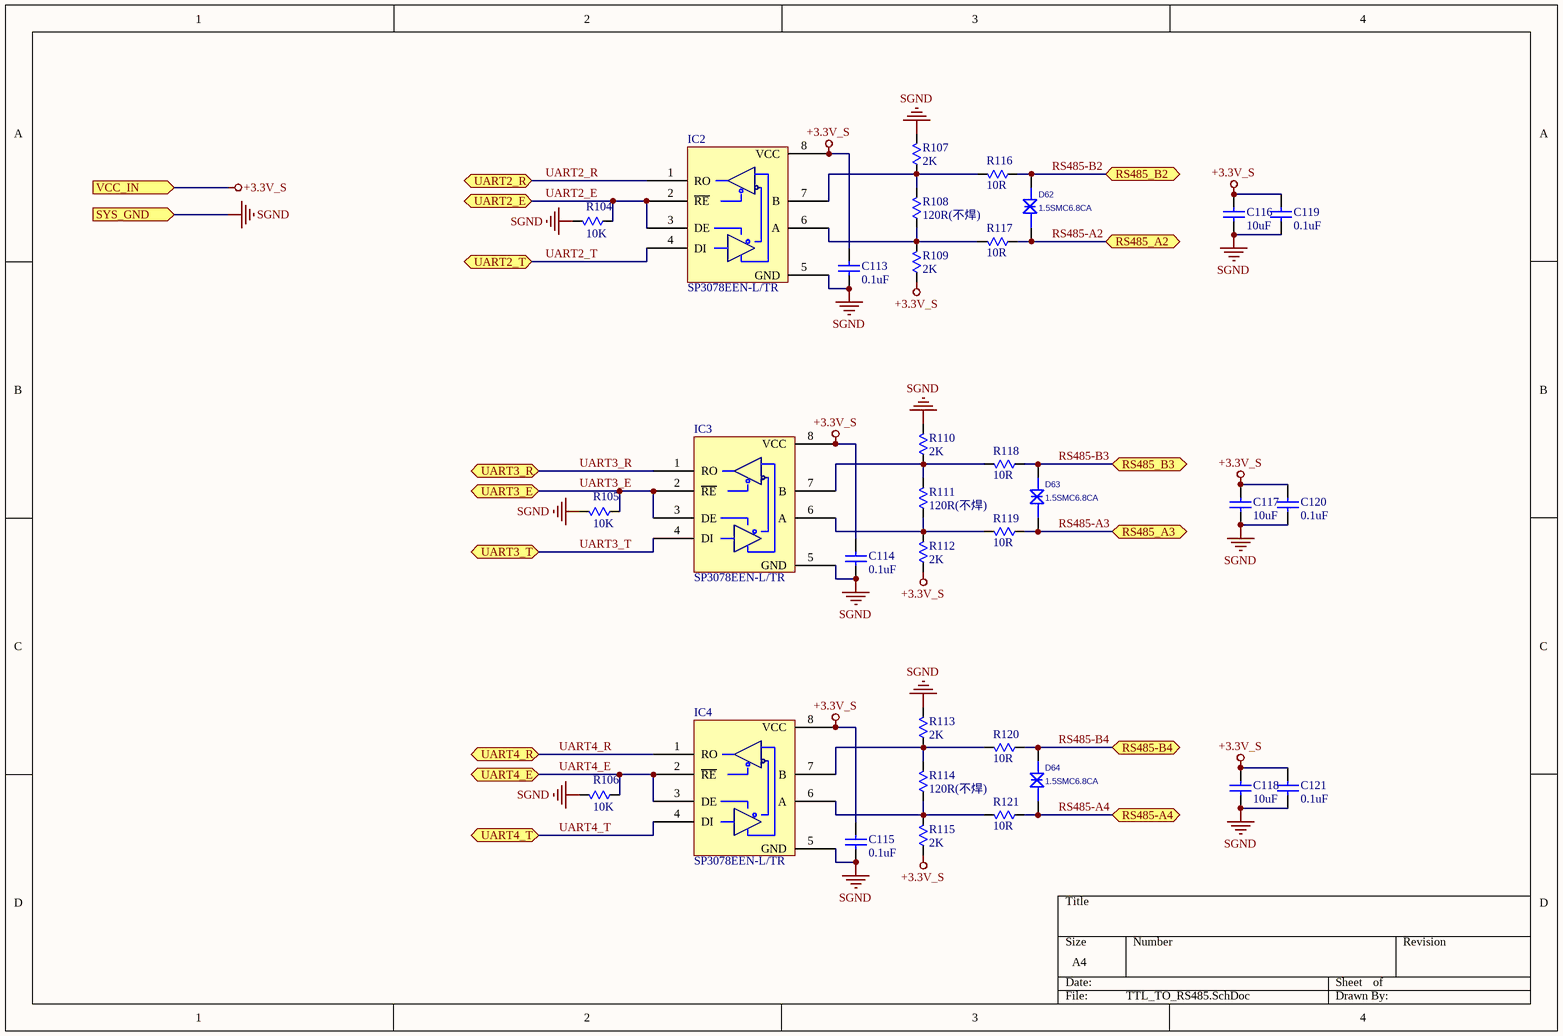
[diagram p5: TTL_TO_RS485.SchDoc]

### Parts
C113  0.1uF  [C0805]
C114  0.1uF  [C0805]
C115  0.1uF  [C0805]
C116  10uF  [C1206]
C117  10uF  [C1206]
C118  10uF  [C1206]
C119  0.1uF  [C1206]
C120  0.1uF  [C1206]
C121  0.1uF  [C1206]
D62  1.5SMC6.8CA  [SMC]
D63  1.5SMC6.8CA  [SMC]
D64  1.5SMC6.8CA  [SMC]
IC2  SP3078EEN-L/TR  [SO-8]
IC3  SP3078EEN-L/TR  [SO-8]
IC4  SP3078EEN-L/TR  [SO-8]
R104  10K  [R0805]
R105  10K  [R0805]
R106  10K  [R0805]
R107  2K  [R0805]
R108  120R(不焊)  [R0805]
R109  2K  [R0805]
R110  2K  [R0805]
R111  120R(不焊)  [R0805]
R112  2K  [R0805]
R113  2K  [R0805]
R114  120R(不焊)  [R0805]
R115  2K  [R0805]
R116  10R  [R0805]
R117  10R  [R0805]
R118  10R  [R0805]
R119  10R  [R0805]
R120  10R  [R0805]
R121  10R  [R0805]

### Ports
RS485-A4 (bidir), RS485-B4 (bidir), RS485_A2 (bidir), RS485_A3 (bidir), RS485_B2 (bidir), RS485_B3 (bidir), SYS_GND (in), UART2_E (bidir), UART2_R (bidir), UART2_T (bidir), UART3_E (bidir), UART3_R (bidir), UART3_T (bidir), UART4_E (bidir), UART4_R (bidir), UART4_T (bidir), VCC_IN (in)

### Nets
+3.3V_S: C113.2 C114.2 C115.2 C116.2 C117.2 C118.2 C119.2 C120.2 C121.2 IC2.8(VCC) IC3.8(VCC) IC4.8(VCC) R109.1 R112.1 R115.1 ; port VCC_IN
SGND: C113.1 C114.1 C115.1 C116.1 C117.1 C118.1 C119.1 C120.1 C121.1 IC2.5(GND) IC3.5(GND) IC4.5(GND) R104.2 R105.2 R106.2 R107.2 R110.2 R113.2 ; port SYS_GND
RS485-A2: D62.2 R117.1 ; port RS485_A2
RS485-A3: D63.2 R119.1 ; port RS485_A3
RS485-A4: D64.2 R121.1 ; port RS485-A4
RS485-B2: D62.1 R116.1 ; port RS485_B2
RS485-B3: D63.1 R118.1 ; port RS485_B3
RS485-B4: D64.1 R120.1 ; port RS485-B4
UART2_E: IC2.2(~{RE}) IC2.3(DE) R104.1 ; port UART2_E
UART2_R: IC2.1(RO) ; port UART2_R
UART2_T: IC2.4(DI) ; port UART2_T
UART3_E: IC3.2(~{RE}) IC3.3(DE) R105.1 ; port UART3_E
UART3_R: IC3.1(RO) ; port UART3_R
UART3_T: IC3.4(DI) ; port UART3_T
UART4_E: IC4.2(~{RE}) IC4.3(DE) R106.1 ; port UART4_E
UART4_R: IC4.1(RO) ; port UART4_R
UART4_T: IC4.4(DI) ; port UART4_T
NetIC2_6: IC2.6(A) R108.1 R109.2 R117.2
NetIC2_7: IC2.7(B) R107.1 R108.2 R116.2
NetIC3_6: IC3.6(A) R111.1 R112.2 R119.2
NetIC3_7: IC3.7(B) R110.1 R111.2 R118.2
NetIC4_6: IC4.6(A) R114.1 R115.2 R121.2
NetIC4_7: IC4.7(B) R113.1 R114.2 R120.2

### Library data of the parts
C113-C121 = CAP: Published: 8-Jun-2000; LatestRevisionDate: 17-Jul-2002; LatestRevisionNote: Re-released for DXP Platform.; PackageReference: RAD-0.3; Publisher: Altium Limited
  C113-C115 C119-C121: Value: 0.1uF
  C116-C118: Value: 10uF
D62-D64 = P0080_1: Part Descriptions: Polymar ESD; Manufacturer: SemiTel; Part Type: ESD
IC2-IC4 = SP3078EEN
R104-R121 = RES: Resistor; Published: 8-Jun-2000; LatestRevisionDate: 17-Jul-2002; LatestRevisionNote: Re-released for DXP Platform.; PackageReference: AXIAL-0.3; Publisher: Altium Limited
  R104-R106: Value: 10K
  R107 R109 R110 R112 R113 R115: Value: 2K
  R108 R111 R114: Value: 120R(不焊)
  R116-R121: Value: 10R

## Sheet RightInterface.SchDoc
size A4
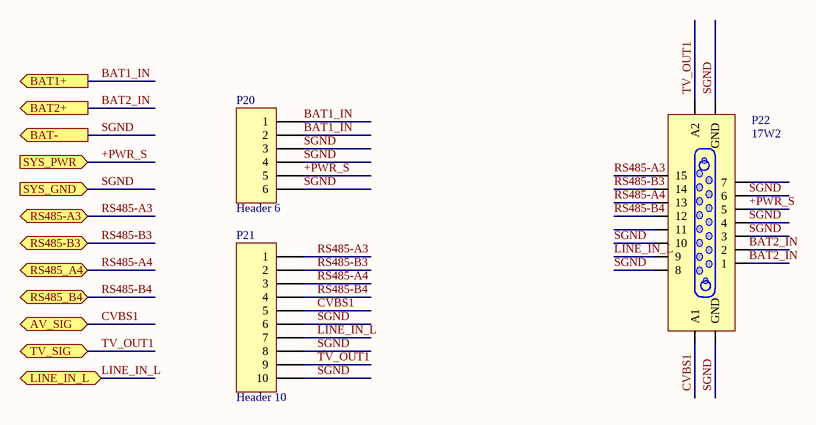
[diagram p6: RightInterface.SchDoc]

### Parts
P20  Header 6  [DS1X6-2.54]
P21  Header 10  [DS1X10-2.54]
P22  17W2  [17W2_FEMALE]

### Ports
AV_SIG (bidir), BAT1+ (out), BAT2+ (out), BAT- (out), LINE_IN_L (bidir), RS485-A3 (bidir), RS485-B3 (bidir), RS485_A4 (bidir), RS485_B4 (bidir), SYS_GND (in), SYS_PWR (in), TV_SIG (bidir)

### Nets
+PWR_S: P20.5 P22.5 ; port SYS_PWR
SGND: P20.3 P20.4 P20.6 P21.6 P21.8 P21.10 P22.3 P22.4 P22.6 P22.8 P22.10 P22.17(GND) P22.19(GND) ; port BAT-, port SYS_GND
BAT1_IN: P20.1 P20.2 ; port BAT1+
BAT2_IN: P22.1 P22.2 ; port BAT2+
CVBS1: P21.5 P22.16(A1) ; port AV_SIG
LINE_IN_L: P21.7 P22.9 ; port LINE_IN_L
RS485-A3: P21.1 P22.15 ; port RS485-A3
RS485-A4: P21.3 P22.13 ; port RS485_A4
RS485-B3: P21.2 P22.14 ; port RS485-B3
RS485-B4: P21.4 P22.12 ; port RS485_B4
TV_OUT1: P21.9 P22.18(A2) ; port TV_SIG

Not connected (* = marked no-connect by the designer): P22 7 11

### Library data of the parts
P20 = Header 6: Header, 6-Pin; LatestRevisionDate: 17-Jul-2002; LatestRevisionNote: Re-released for DXP Platform.; Publisher: Altium Limited
P21 = Header 10: Header, 10-Pin; LatestRevisionDate: 17-Jul-2002; LatestRevisionNote: Re-released for DXP Platform.; Publisher: Altium Limited
P22 = 17W2: Connector

## Nets that join several sheets
+2.5V_S: PowerManager (5 pins), JoyStickAdcInput (6 pins)
+3.3V_S: PowerManager (C20.1 C25.2 U2.3), KeyInput_ABH (21 pins), KeyInput_IJMEF (14 pins), TTL_TO_RS485 (15 pins)
+PWR_S: PowerManager (10 pins), OmapSystem (10 pins), RightInterface (P20.5 P22.5)
SGND: PowerManager (40 pins), KeyInput_ABH (49 pins), KeyInput_IJMEF (38 pins), JoyStickAdcInput (18 pins), OmapSystem (38 pins), TTL_TO_RS485 (18 pins), RightInterface (13 pins)
BAT1_IN: PowerManager (F1.1 F2.1), RightInterface (P20.1 P20.2)
BAT2_IN: PowerManager (F3.1 F4.1), RightInterface (P22.1 P22.2)
CVBS1: OmapSystem (PA1.23), RightInterface (P21.5 P22.16)
LINE_IN_L: OmapSystem (P17.3 PB1.8), RightInterface (P21.7 P22.9)
RS485-A3: TTL_TO_RS485 (D63.2 R119.1), RightInterface (P21.1 P22.15)
RS485-A4: TTL_TO_RS485 (D64.2 R121.1), RightInterface (P21.3 P22.13)
RS485-B3: TTL_TO_RS485 (D63.1 R118.1), RightInterface (P21.2 P22.14)
RS485-B4: TTL_TO_RS485 (D64.1 R120.1), RightInterface (P21.4 P22.12)
TV_OUT1: OmapSystem (PB1.12), RightInterface (P21.9 P22.18)